# Altium schematic sheet STM32F405RGT6.SchDoc
size A3
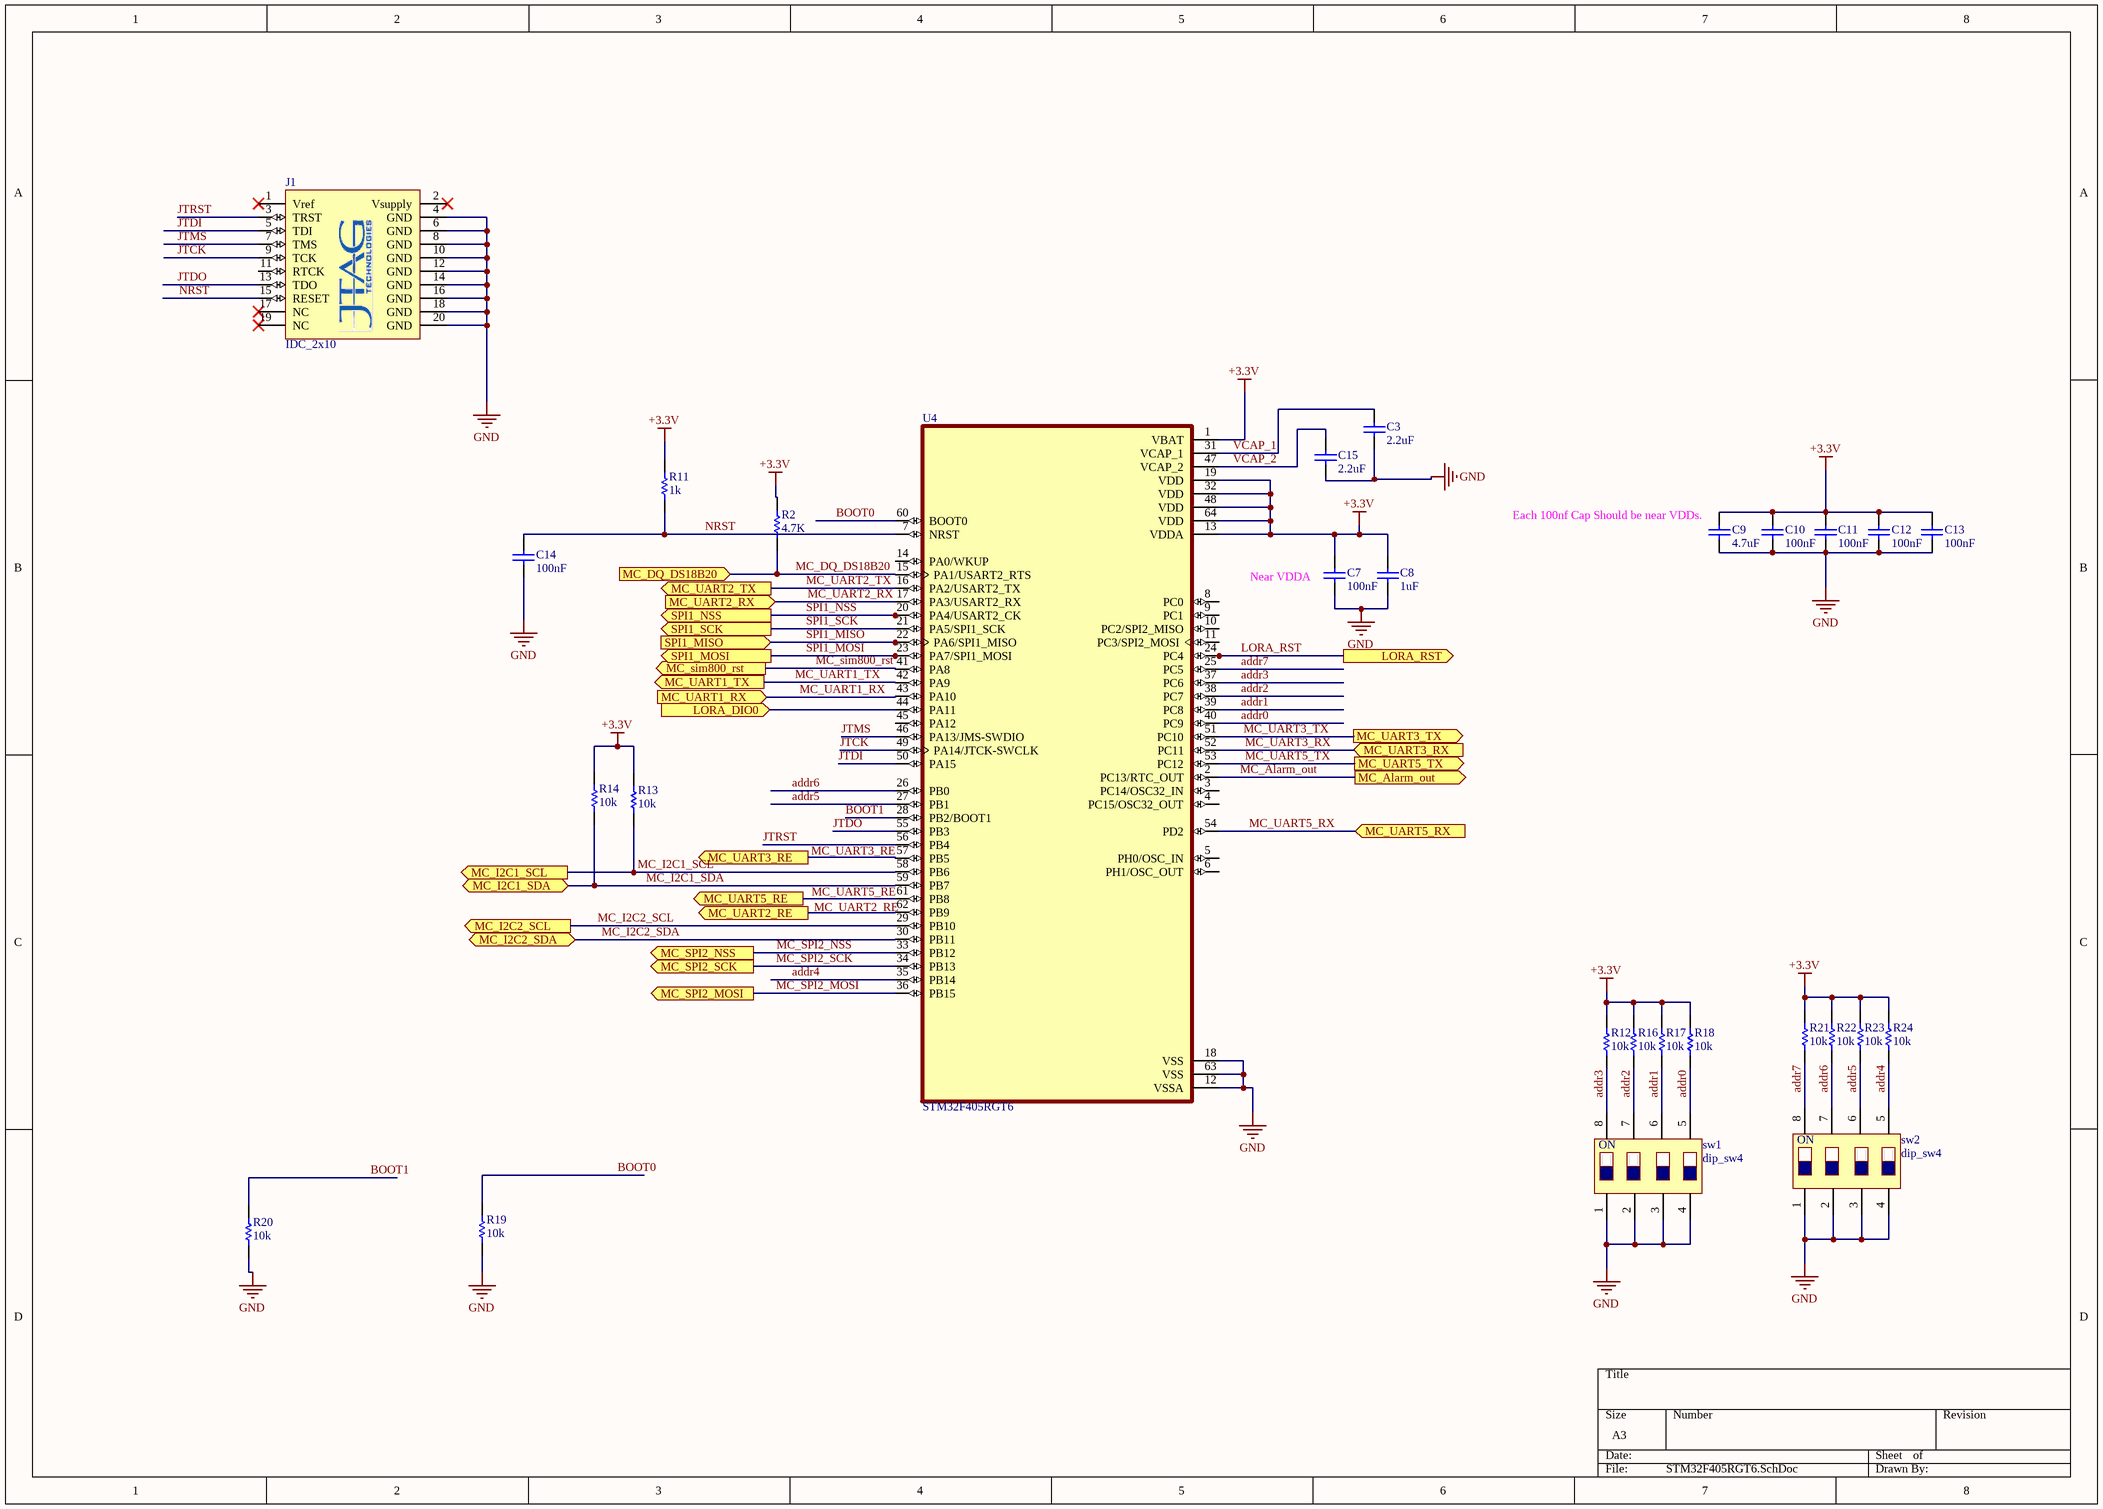
[diagram p0: STM32F405RGT6.SchDoc]

## Parts
C3  value 2.2uF  [C-805]  (hidden comment: C-805)
C7  value 100nF  [C-805]  (hidden comment: C-805)
C8  value 1uF  [C-805]  (hidden comment: C-805)
C9  value 4.7uF  [C-1206]  (hidden comment: C-1206)
C10  value 100nF  [C-603]  (hidden comment: C-603)
C11  value 100nF  [C-603]  (hidden comment: C-603)
C12  value 100nF  [C-603]  (hidden comment: C-603)
C13  value 100nF  [C-603]  (hidden comment: C-603)
C14  value 100nF  [C-805]  (hidden comment: C-805)
C15  value 2.2uF  [C-805]  (hidden comment: C-805)
J1  IDC_2x10  [IDC2.54-V20D]
R2  value 4.7K  [R-805]  (hidden comment: R-805)
R11  value 1k  [R-805]  (hidden comment: R-805)
R12  value 10k  [R-805]  (hidden comment: R-805)
R13  value 10k  [R-805]  (hidden comment: R-805)
R14  value 10k  [R-805]  (hidden comment: R-805)
R16  value 10k  [R-805]  (hidden comment: R-805)
R17  value 10k  [R-805]  (hidden comment: R-805)
R18  value 10k  [R-805]  (hidden comment: R-805)
R19  value 10k  [R-805]  (hidden comment: R-805)
R20  value 10k  [R-805]  (hidden comment: R-805)
R21  value 10k  [R-805]  (hidden comment: R-805)
R22  value 10k  [R-805]  (hidden comment: R-805)
R23  value 10k  [R-805]  (hidden comment: R-805)
R24  value 10k  [R-805]  (hidden comment: R-805)
sw1  dip_sw4  [dipSW_4]
sw2  dip_sw4  [dipSW_4]
U4  STM32F405RGT6  [stm32f405rgt6]

## Ports
LORA_DIO0 (in), LORA_RST (out), MC_Alarm_out (out), MC_DQ_DS18B20 (in), MC_I2C1_SCL (out), MC_I2C1_SDA (bidir), MC_I2C2_SCL (out), MC_I2C2_SDA (bidir), MC_sim800_rst (out), MC_SPI2_MOSI (out), MC_SPI2_NSS (out), MC_SPI2_SCK (out), MC_UART1_RX (in), MC_UART1_TX (out), MC_UART2_RE (out), MC_UART2_RX (in), MC_UART2_TX (out), MC_UART3_RE (out), MC_UART3_RX (in), MC_UART3_TX (out), MC_UART5_RE (out), MC_UART5_RX (in), MC_UART5_TX (out), SPI1_MISO (in), SPI1_MOSI (out), SPI1_NSS (out), SPI1_SCK (out)

## Nets
+3.3V: C7.1 C8.2 C9.2 C10.1 C11.1 C12.1 C13.1 R2.2 R11.2 R12.2 R13.2 R14.2 R16.2 R17.2 R18.2 R21.2 R22.2 R23.2 R24.2 U4.1(VBAT) U4.13(VDDA) U4.19(VDD) U4.32(VDD) U4.48(VDD) U4.64(VDD)
GND: C3.1 C7.2 C8.1 C9.1 C10.2 C11.2 C12.2 C13.2 C14.2 C15.1 J1.4(GND) J1.6(GND) J1.8(GND) J1.10(GND) J1.12(GND) J1.14(GND) J1.16(GND) J1.18(GND) J1.20(GND) R19.1 R20.2 sw1.1 sw1.2 sw1.3 sw1.4 sw2.1 sw2.2 sw2.3 sw2.4 U4.12(VSSA) U4.18(VSS) U4.63(VSS)
addr0: R18.1 sw1.5 U4.40(PC9)
addr1: R17.1 sw1.6 U4.39(PC8)
addr2: R16.1 sw1.7 U4.38(PC7)
addr3: R12.1 sw1.8 U4.37(PC6)
addr4: R24.1 sw2.5 U4.35(PB14)
addr5: R23.1 sw2.6 U4.27(PB1)
addr6: R22.1 sw2.7 U4.26(PB0)
addr7: R21.1 sw2.8 U4.25(PC5)
BOOT0: R19.2 U4.60(BOOT0)
BOOT1: R20.1 U4.28(PB2/BOOT1)
JTCK: J1.9(TCK) U4.49(PA14/JTCK-SWCLK)
JTDI: J1.5(TDI) U4.50(PA15)
JTDO: J1.13(TDO) U4.55(PB3)
JTMS: J1.7(TMS) U4.46(PA13/JMS-SWDIO)
JTRST: J1.3(TRST) U4.56(PB4)
LORA_DIO0: U4.44(PA11) ; port LORA_DIO0
LORA_RST: U4.24(PC4) ; port LORA_RST
MC_Alarm_out: U4.2(PC13/RTC_OUT) ; port MC_Alarm_out
MC_DQ_DS18B20: R2.1 U4.15(PA1/USART2_RTS) ; port MC_DQ_DS18B20
MC_I2C1_SCL: R13.1 U4.58(PB6) ; port MC_I2C1_SCL
MC_I2C1_SDA: R14.1 U4.59(PB7) ; port MC_I2C1_SDA
MC_I2C2_SCL: U4.29(PB10) ; port MC_I2C2_SCL
MC_I2C2_SDA: U4.30(PB11) ; port MC_I2C2_SDA
MC_sim800_rst: U4.41(PA8) ; port MC_sim800_rst
MC_SPI2_MOSI: U4.36(PB15) ; port MC_SPI2_MOSI
MC_SPI2_NSS: U4.33(PB12) ; port MC_SPI2_NSS
MC_SPI2_SCK: U4.34(PB13) ; port MC_SPI2_SCK
MC_UART1_RX: U4.43(PA10) ; port MC_UART1_RX
MC_UART1_TX: U4.42(PA9) ; port MC_UART1_TX
MC_UART2_RE: U4.62(PB9) ; port MC_UART2_RE
MC_UART2_RX: U4.17(PA3/USART2_RX) ; port MC_UART2_RX
MC_UART2_TX: U4.16(PA2/USART2_TX) ; port MC_UART2_TX
MC_UART3_RE: U4.57(PB5) ; port MC_UART3_RE
MC_UART3_RX: U4.52(PC11) ; port MC_UART3_RX
MC_UART3_TX: U4.51(PC10) ; port MC_UART3_TX
MC_UART5_RE: U4.61(PB8) ; port MC_UART5_RE
MC_UART5_RX: U4.54(PD2) ; port MC_UART5_RX
MC_UART5_TX: U4.53(PC12) ; port MC_UART5_TX
NRST: C14.1 J1.15(RESET) R11.1 U4.7(NRST)
SPI1_MISO: U4.22(PA6/SPI1_MISO) ; port SPI1_MISO
SPI1_MOSI: U4.23(PA7/SPI1_MOSI) ; port SPI1_MOSI
SPI1_NSS: U4.20(PA4/USART2_CK) ; port SPI1_NSS
SPI1_SCK: U4.21(PA5/SPI1_SCK) ; port SPI1_SCK
VCAP_1: C3.2 U4.31(VCAP_1)
VCAP_2: C15.2 U4.47(VCAP_2)

Not connected (* = marked no-connect by the designer): J1 1(Vref)* 2(Vsupply)* 11(RTCK) 17(NC)* 19(NC)*; U4 3(PC14/OSC32_IN) 4(PC15/OSC32_OUT) 5(PH0/OSC_IN) 6(PH1/OSC_OUT) 8(PC0) 9(PC1) 10(PC2/SPI2_MISO) 11(PC3/SPI2_MOSI) 14(PA0/WKUP) 45(PA12)

## Notes on the sheet
- (near C9) Each 100nf Cap Should be near VDDs.
- (near C7) Near VDDA
- Labels drawn without touching a wire or pin: MC_UART2_RE, MC_UART3_RE, MC_UART5_RE
- (in symbol dip_sw4) ON

## Library data of the parts
C3 C7 C8 C14 C15 = C-805: Capacitor; Published: 8-Jun-2000; LatestRevisionDate: 29-May-2009; LatestRevisionNote: IPC-7351 Footprint Added.; PackageReference: C1206; Publisher: Altium Limited; PackageDescription: Chip Capacitor
C9 = C-1206: Capacitor; Published: 8-Jun-2000; LatestRevisionDate: 29-May-2009; LatestRevisionNote: IPC-7351 Footprint Added.; PackageReference: C1206; Publisher: Altium Limited; PackageDescription: Chip Capacitor
C10-C13 = C-603: Capacitor; Published: 8-Jun-2000; LatestRevisionDate: 29-May-2009; LatestRevisionNote: IPC-7351 Footprint Added.; PackageReference: C1206; Publisher: Altium Limited; PackageDescription: Chip Capacitor
J1 = JTAG_JLINK: 20 Pin Standard JTAG Header For ARM JLINK; Company: SJ Libraries; Connector type: IDC2.54-20; designer: Eng. Saeid Jorablo; Max Current: mA; Positions: 20; Revision 1: 7/8/2012: Create Model; Category: Headers; ComponentLink1Description: Datasheet; ComponentLink2Description: Reference; Mounting Technology: Through-Hole; Orientation: Vertical; Pin Count: 20; Publisher: SJ UnLimited; Status: Unreleased; Update: 7/8/2012; HelpURL: http://s3.picofile.com/file/7443264187/Coming_Soon_logo.gif
R2 R11-R14 R16-R24 = R-805: Resistor
sw1 sw2 = dip_sw4: dip switch, 4-Pin; LatestRevisionDate: 17-Jul-2002; LatestRevisionNote: Re-released for DXP Platform.; Publisher: Altium Limited
U4 = STM32F405RGT6: ARMÂ® CortexÂ®-M4 STM32F4 Microcontroller IC 32-Bit 168MHz 1MB _1M x 8_ FLASH 64-LQFP _10x10_; MF: STMicroelectronics; Package: LQFP-64 STMicroelectronics; Digi-Key_Purchase_URL: https://www.digikey.com/product-detail/en/stmicroelectronics/STM32F405RGT6/497-11767-ND/2754208?utm_source=snapeda&utm_medium=aggregator&utm_campaign=symbol; Value: *; MP: STM32F405RGT6; SnapEDA_Link: https://www.snapeda.com/parts/STM32F405RGT6/STMicroelectronics/view-part/105502/?ref=snap; Digi-Key_Part_Number: 497-11767-ND